# Altium project 2011_CurrentIntegrator.PrjPcb
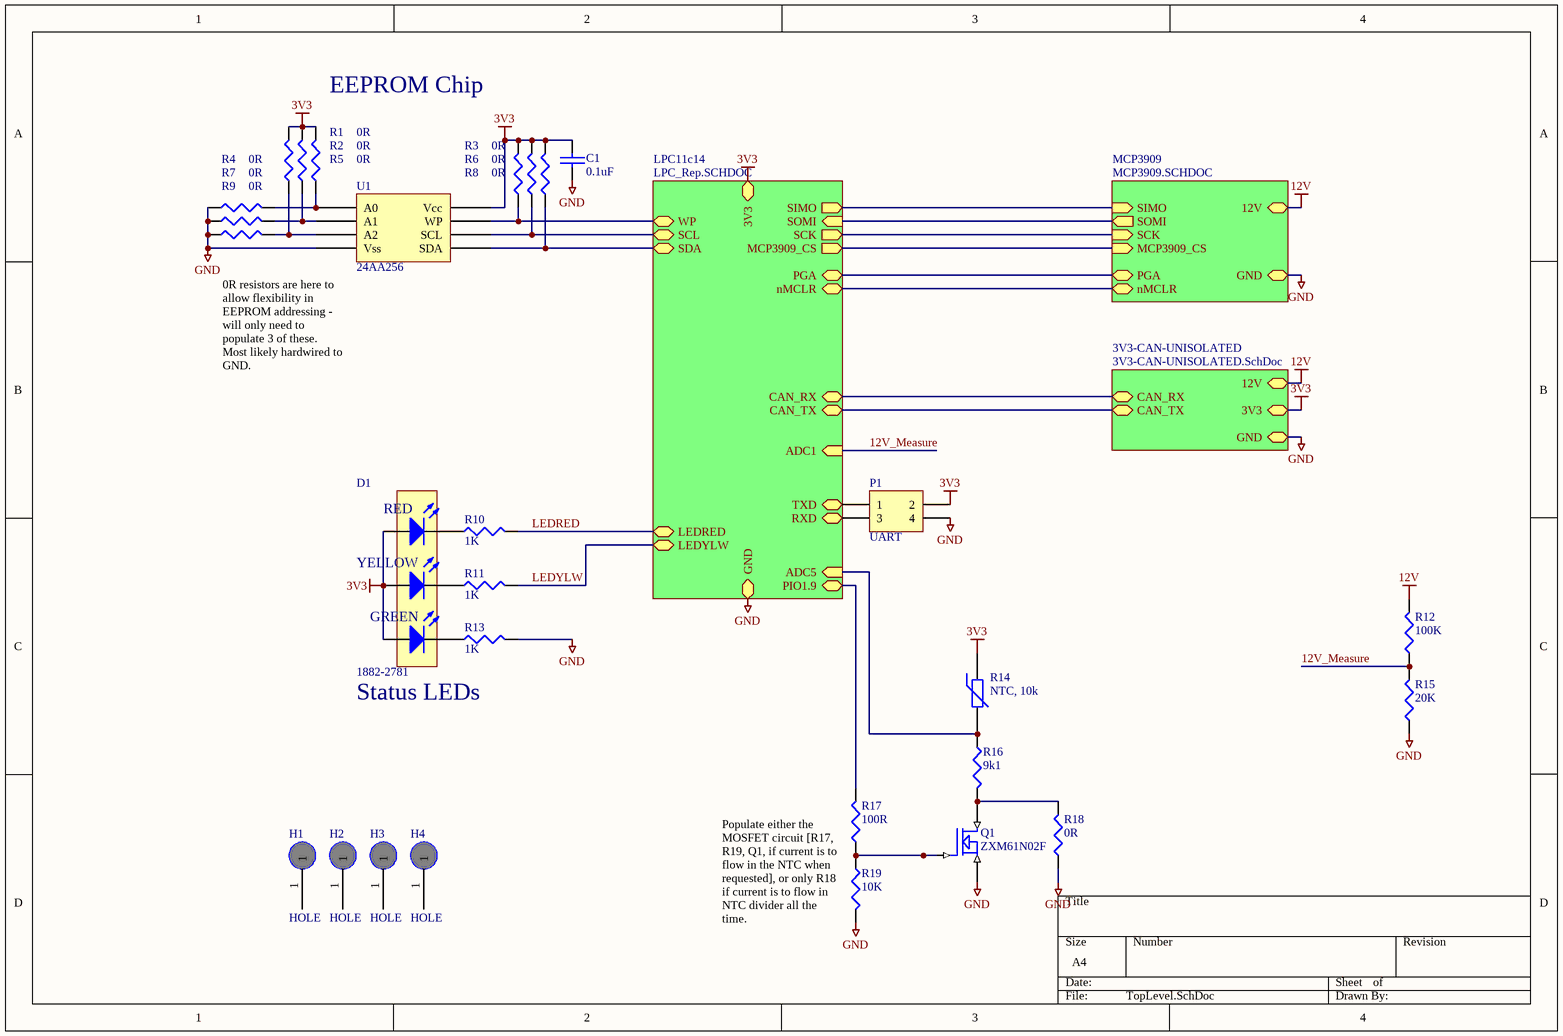
[diagram p0: TopLevel.SchDoc]
5 sheets, 113 parts. Net scope: hierarchical (ports join the sheet entries above them; power ports are global).
Board file: 2011_CurrentIntegrator2.PcbDoc
Sheets:
  TopLevel.SchDoc
    LPC11c14 = LPC_Rep.SchDoc
    MCP3909 = MCP3909.SchDoc
    3V3-CAN-UNISOLATED = 3V3-CAN-UNISOLATED.SchDoc
      U_3V-Switcher-50mA = 3V-Switcher-50mA.SCHDOC

## Sheet TopLevel.SchDoc
size A4

### Parts
C1  0.1uF  [0805]
D1  1882-2781  [LED_TRILEVEL]
H1  HOLE  [M2.5]
H2  HOLE  [M2.5]
H3  HOLE  [M2.5]
H4  HOLE  [M2.5]
P1  UART  [HDR2X2]
Q1  ZXM61N02F  [SOT23-3]
R1  0R  [0603]
R2  0R  [0603]
R3  0R  [0603]
R4  0R  [0603]
R5  0R  [0603]
R6  0R  [0603]
R7  0R  [0603]
R8  0R  [0603]
R9  0R  [0603]
R10  1K  [0603]
R11  1K  [0603]
R12  100K  [1206]
R13  1K  [0603]
R14  NTC, 10k  [NTC_EPCOS]
R15  20K  [1206]
R16  9k1  [0603]
R17  100R  [0603]
R18  0R  [0603]
R19  10K  [0603]
U1  24AA256  [DIP8]

### Sub-sheets
3V3-CAN-UNISOLATED = 3V3-CAN-UNISOLATED.SchDoc: CAN_RX, CAN_TX, GND, 12V, 3V3
LPC11c14 = LPC_Rep.SCHDOC: SIMO (out), SOMI (in), SCK (out), MCP3909_CS (out), PGA, nMCLR, CAN_RX, CAN_TX, 3V3, GND, SCL, SDA, WP, LEDRED, LEDYLW, ADC5 (in), PIO1.9, ADC1 (in), TXD, RXD
MCP3909 = MCP3909.SCHDOC: SIMO (in), SOMI (out), SCK (in), MCP3909_CS (in), PGA, nMCLR, 12V, GND

### Nets
3V3: C1.1 D1.4(A) D1.5(A) D1.6(A) P1.2 R1.2 R2.2 R3.2 R5.2 R6.2 R8.2 R14.1 U1.8(Vcc) ; sheet LPC11c14/3V3, sheet 3V3-CAN-UNISOLATED/3V3
12V: R12.2 ; sheet MCP3909/12V, sheet 3V3-CAN-UNISOLATED/12V
GND: C1.2 P1.4 Q1.2(S) R4.1 R7.1 R9.1 R13.2 R15.1 R18.1 R19.2 U1.4(Vss) ; sheet LPC11c14/GND, sheet MCP3909/GND, sheet 3V3-CAN-UNISOLATED/GND
12V_Measure: R12.1 R15.2 ; sheet LPC11c14/ADC1
LEDRED: R10.2 ; sheet LPC11c14/LEDRED
LEDYLW: R11.2 ; sheet LPC11c14/LEDYLW
NetD1_1: D1.1(K) R13.1
NetD1_2: D1.2(K) R11.1
NetD1_3: D1.3(K) R10.1
NetP1_1: P1.1 ; sheet LPC11c14/TXD
NetP1_3: P1.3 ; sheet LPC11c14/RXD
NetQ1_1: Q1.1(G) R17.1 R19.1
NetQ1_3: Q1.3(D) R16.2 R18.2
NetR1_1: R1.1 R4.2 U1.1(A0)
NetR2_1: R2.1 R7.2 U1.2(A1)
NetR3_1: R3.1 U1.5(SDA) ; sheet LPC11c14/SDA
NetR5_1: R5.1 R9.2 U1.3(A2)
NetR6_1: R6.1 U1.6(SCL) ; sheet LPC11c14/SCL
NetR8_1: R8.1 U1.7(WP) ; sheet LPC11c14/WP
NetR14_2: R14.2 R16.1 ; sheet LPC11c14/ADC5
NetR17_2: R17.2 ; sheet LPC11c14/PIO1.9
NetU2_1: sheet LPC11c14/CAN_TX, sheet 3V3-CAN-UNISOLATED/CAN_TX
NetU2_4: sheet LPC11c14/CAN_RX, sheet 3V3-CAN-UNISOLATED/CAN_RX
NetU3_11: sheet LPC11c14/PGA, sheet MCP3909/PGA
NetU3_12: sheet LPC11c14/nMCLR, sheet MCP3909/nMCLR
NetU3_13: sheet LPC11c14/SCK, sheet MCP3909/SCK
NetU3_26: sheet LPC11c14/SOMI, sheet MCP3909/SOMI
NetU3_27: sheet LPC11c14/MCP3909_CS, sheet MCP3909/MCP3909_CS
NetU3_38: sheet LPC11c14/SIMO, sheet MCP3909/SIMO

Not connected (* = marked no-connect by the designer): H1 1; H2 1; H3 1; H4 1

### Notes on the sheet
- EEPROM Chip
- 0R resistors are here to allow flexibility in EEPROM addressing - will only need to populate 3 of these. Most likely hardwired to GND.
- Status LEDs
- Populate either the MOSFET circuit [R17, R19, Q1, if current is to flow in the NTC when requested], or only R18 if current is to flow in NTC divider all the time.
- (in symbol LED-TRILEVEL) RED; YELLOW; GREEN

### Library data of the parts
C1 = CAP: Capacitor; Order#: ??; Price: ??; Supplier: ??
D1 = LED-TRILEVEL: Three level LED; Farnell: 1461596
P1 = Header 2X2: Header, 2-Pin, Dual row; LatestRevisionDate: 17-Jul-2002; LatestRevisionNote: Re-released for DXP Platform.; Publisher: Altium Limited
Q1 = ZXM61N02F: 1.7A, 20V N-Channel Enhancement mode FET; Order#: 9525270; Price: 0.803; Supplier: Farnell
R1-R9 = RES1: Resistor; Order#: 933-1697; Price: 0.11; Supplier: Farnell
R10 R11 R13 = RES1: Resistor; Order#: 9331697; Supplier: Farnell; Price: 0.05
R12 R15 = RES1: Resistor; Farnell: *
R14 = Res Varistor: Varistor (Voltage-Sensitive Resistor); EPCOS: B57540G0103F00; Farnell: 1712520
R16 = RES1: Resistor; Order#: 9330380; Supplier: Farnell; Price: 0.066
R17-R19 = RES1: Resistor; Order#: 9233253; Supplier: Farnell; Price: 0.088

## Sheet LPC_Rep.SchDoc
size A4; Organization: UNSW Solar Racing Team; Address3: UNSW; Address4: Sydney NSW 2052; Address2: Electrical Engineering; Address1: Rm 109
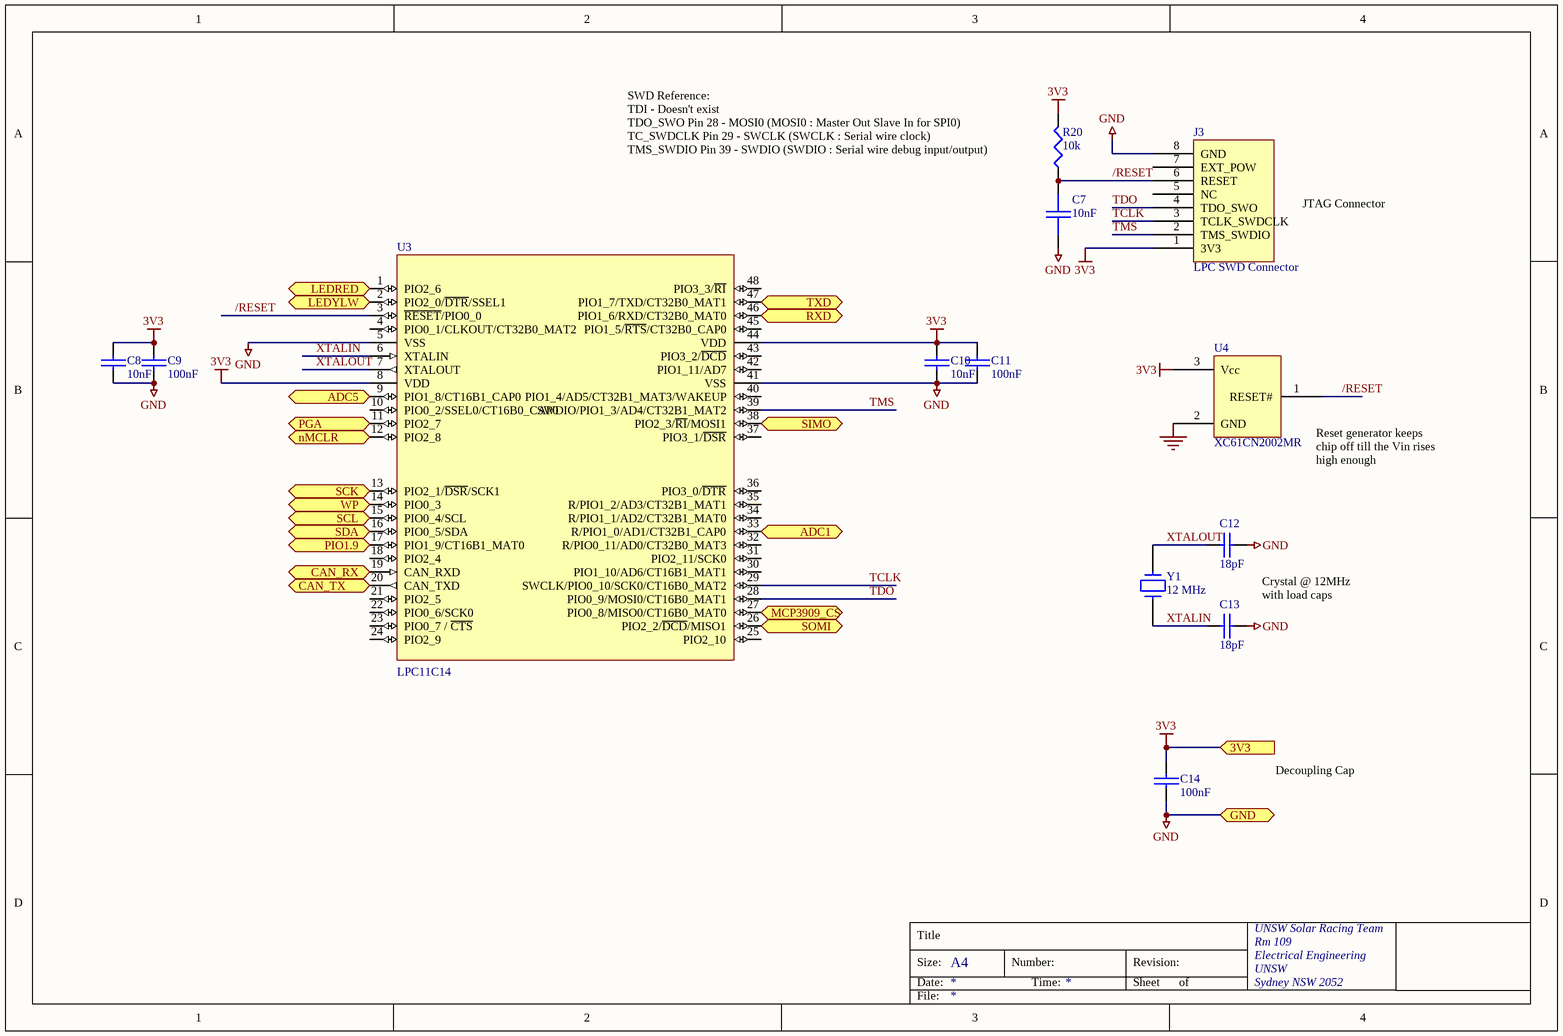
[diagram p1: LPC_Rep.SchDoc]

### Parts
C7  10nF  [0603]
C8  10nF  [0603]
C9  100nF  [0603]
C10  10nF  [0603]
C11  100nF  [0603]
C12  18pF  [0603]
C13  18pF  [0603]
C14  100nF  [0603]
J3  LPC SWD Connector  [IDC8]
R20  10k  [0603]
U3  LPC11C14  [Quad48-LPC11c14]
U4  XC61CN2002MR  [SOT23-3]
Y1  12 MHz  [HC49/4H]

### Ports
3V3, ADC1 (in), ADC5 (in), CAN_RX (in), CAN_TX (out), GND, LEDRED (bidir), LEDYLW (bidir), MCP3909_CS, nMCLR, PGA, PIO1.9 (bidir), RXD (bidir), SCK (bidir), SCL (bidir), SDA (bidir), SIMO (bidir), SOMI (bidir), TXD (bidir), WP (bidir)

### Nets
3V3: C8.2 C9.2 C10.2 C11.2 C14.1 J3.1(3V3) R20.2 U3.8(VDD) U3.44(VDD) U4.3(Vcc) ; port 3V3
GND: C7.2 C8.1 C9.1 C10.1 C11.1 C12.2 C13.2 C14.2 J3.8(GND) U3.5(VSS) U3.41(VSS) U4.2(GND) ; port GND
12V_Measure: U3.33(R/PIO1_0/AD1/CT32B1_CAP0) ; port ADC1
/RESET: C7.1 J3.6(RESET) R20.1 U3.3(~{RESET}/PIO0_0) U4.1(RESET#)
LEDRED: U3.1(PIO2_6) ; port LEDRED
LEDYLW: U3.2(PIO2_0/~{DTR}/SSEL1) ; port LEDYLW
TCLK: J3.3(TCLK_SWDCLK) U3.29(SWCLK/PIO0_10/SCK0/CT16B0_MAT2)
TDO: J3.4(TDO_SWO) U3.28(PIO0_9/MOSI0/CT16B0_MAT1)
TMS: J3.2(TMS_SWDIO) U3.39(SWDIO/PIO1_3/AD4/CT32B1_MAT2)
XTALIN: C13.1 U3.6(XTALIN) Y1.1
XTALOUT: C12.1 U3.7(XTALOUT) Y1.2
NetP1_1: U3.47(PIO1_7/TXD/CT32B0_MAT1) ; port TXD
NetP1_3: U3.46(PIO1_6/RXD/CT32B0_MAT0) ; port RXD
NetR3_1: U3.16(PIO0_5/SDA) ; port SDA
NetR6_1: U3.15(PIO0_4/SCL) ; port SCL
NetR8_1: U3.14(PIO0_3) ; port WP
NetR14_2: U3.9(PIO1_8/CT16B1_CAP0) ; port ADC5
NetR17_2: U3.17(PIO1_9/CT16B1_MAT0) ; port PIO1.9
NetU2_1: U3.20(CAN_TXD) ; port CAN_TX
NetU2_4: U3.19(CAN_RXD) ; port CAN_RX
NetU3_11: U3.11(PIO2_7) ; port PGA
NetU3_12: U3.12(PIO2_8) ; port nMCLR
NetU3_13: U3.13(PIO2_1/~{DSR}/SCK1) ; port SCK
NetU3_26: U3.26(PIO2_2/~{DCD}/MISO1) ; port SOMI
NetU3_27: U3.27(PIO0_8/MISO0/CT16B0_MAT0) ; port MCP3909_CS
NetU3_38: U3.38(PIO2_3/~{RI}/MOSI1) ; port SIMO

Not connected (* = marked no-connect by the designer): J3 5(NC) 7(EXT_POW); U3 4(PIO0_1/CLKOUT/CT32B0_MAT2) 10(PIO0_2/SSEL0/CT16B0_CAP0) 18(PIO2_4) 21(PIO2_5) 22(PIO0_6/SCK0) 23(PIO0_7_/_~{CTS}) 24(PIO2_9) 25(PIO2_10) 30(PIO1_10/AD6/CT16B1_MAT1) 31(PIO2_11/SCK0) 32(R/PIO0_11/AD0/CT32B0_MAT3) 34(R/PIO1_1/AD2/CT32B1_MAT0) 35(R/PIO1_2/AD3/CT32B1_MAT1) 36(PIO3_0/~{DTR}) 37(PIO3_1/~{DSR}) 40(PIO1_4/AD5/CT32B1_MAT3/WAKEUP) 42(PIO1_11/AD7) 43(PIO3_2/~{DCD}) 45(PIO1_5/~{RTS}/CT32B0_CAP0) 48(PIO3_3/~{RI})

### Notes on the sheet
- SWD Reference:
  TDI - Doesn't exist
  TDO_SWO Pin 28 - MOSI0 (MOSI0 : Master Out Slave In for SPI0)
  TC_SWDCLK Pin 29 - SWCLK (SWCLK : Serial wire clock)
  TMS_SWDIO Pin 39 - SWDIO (SWDIO : Serial wire debug input/output)
- JTAG Connector
- (near U4) Reset generator keeps chip off till the Vin rises high enough
- Crystal @ 12MHz with load caps
- Decoupling Cap
- Title
- Size:
- Date:
- A4
- Number:
- Time:
- Revision:
- Sheet
- of
- File:

### Library data of the parts
C7-C14 = CAP: Capacitor
  C7: Farnell: 722-236; Price: 0.15
  C8-C11 C14: Farnell: 753-567; Price: 0.31
  C12 C13: Farnell: 721-992; Price: 0.11
J3 = LPCLink_Connector: Farnell: 511-808; Price: 1.32
R20 = RES1: Resistor; Farnell: 612-601; Price: 0.11
U3 = LPC11C14_Full: Farnell: NA
U4 = XC61F: SOT23 reset generator; Farnell: NA
Y1 = CRYSTAL: Farnell: 485-111; Price: 3.38

## Sheet MCP3909.SchDoc
size A4
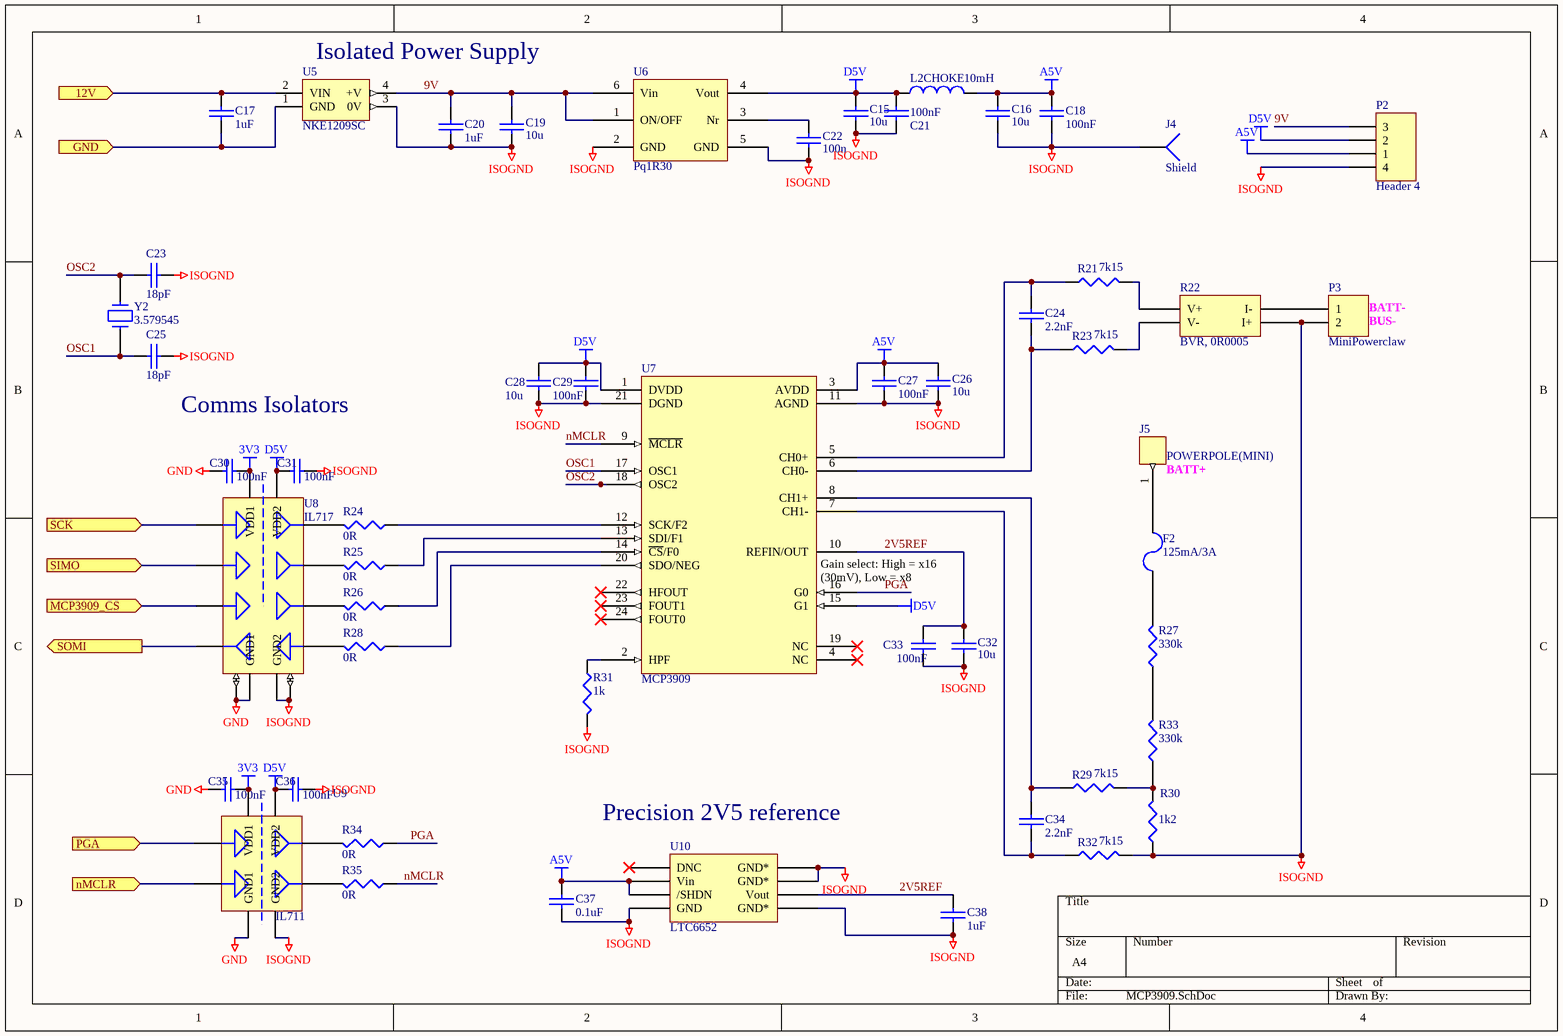
[diagram p2: MCP3909.SchDoc]

### Parts
C15  10u  [0805]
C16  10u  [0805]
C17  1uF  [0805]
C18  100nF  [0603]
C19  10u  [0805]
C20  1uF  [0805]
C21  100nF  [0603]
C22  100n  [0603]
C23  18pF  [0603]
C24  2.2nF  [0603]
C25  18pF  [0603]
C26  10u  [0805]
C27  100nF  [0603]
C28  10u  [0805]
C29  100nF  [0603]
C30  100nF  [0603]
C31  100nF  [0603]
C32  10u  [0805]
C33  100nF  [0603]
C34  2.2nF  [0603]
C35  100nF  [0603]
C36  100nF  [0603]
C37  0.1uF  [0805]
C38  1uF  [0805]
F2  125mA/3A  [LITTELFUSE-154-250V]
J4  Shield  [BMIS-203-SHIELD]
J5  POWERPOLE(MINI)  [POWERPOLE25A]
L2  CHOKE  value 10mH  [1812]
P2  Header 4  [HDR1X4]
P3  MiniPowerclaw  [MiniPowerpole-Hrz]
R21  7k15  [0603]
R22  BVR, 0R0005  [BVR]
R23  7k15  [0603]
R24  0R  [0603]
R25  0R  [0603]
R26  0R  [0603]
R27  330k  [1206]
R28  0R  [0603]
R29  7k15  [0603]
R30  1k2  [1206]
R31  1k  [0603]
R32  7k15  [0603]
R33  330k  [1206]
R34  0R  [0603]
R35  0R  [0603]
U5  NKE1209SC  [NPSIP4]
U6  Pq1R30  [SOT23-6]
U7  MCP3909  [SOP24-wide]
U8  IL717  [SO16]
U9  IL711  [SO8]
U10  LTC6652  [SOP8 - duplicate]
Y2  3.579545  [HC49/4H]

### Ports
12V (in), GND, MCP3909_CS (in), nMCLR (in), PGA (in), SCK (in), SIMO (in), SOMI (out)

### Nets
3V3: C30.2 C35.2 U8.1(VDD1) U9.1(VDD1)
12V: C17.1 U5.2(VIN) ; port 12V
A5V: C16.2 C18.1 C26.2 C27.1 C37.1 L2.2 P2.1 U7.3(AVDD) U10.2(Vin) U10.3(/SHDN)
D5V: C15.2 C21.1 C28.2 C29.2 C31.2 C36.2 L2.1 P2.2 U6.4(Vout) U7.1(DVDD) U7.15(G1) U8.16(VDD2) U9.8(VDD2)
GND: C17.2 C30.1 C35.1 U5.1(GND) U8.2(GND1) U8.8(GND1) U9.4(GND1) ; port GND
ISOGND: C15.1 C16.1 C18.2 C19.1 C20.2 C21.2 C22.1 C23.2 C25.2 C26.1 C27.2 C28.1 C29.1 C31.1 C32.1 C33.2 C36.1 C37.2 C38.1 J4.1 P2.4 P3.2 R22.4(I+) R30.1 R31.2 R32.2 U5.3(0V) U6.2(GND) U6.5(GND) U7.11(AGND) U7.21(DGND) U8.9(GND2) U8.15(GND2) U9.5(GND2) U10.4(GND) U10.5(GND*) U10.7(GND*) U10.8(GND*)
2V5REF: C32.2 C33.1 C38.2 U7.10(REFIN/OUT) U10.6(Vout)
9V: C19.2 C20.1 P2.3 U5.4(+V) U6.1(ON/OFF) U6.6(Vin)
nMCLR: R35.1 U7.9(~{MCLR})
OSC1: C25.1 U7.17(OSC1) Y2.1
OSC2: C23.1 U7.18(OSC2) Y2.2
PGA: R34.1 U7.16(G0)
NetC22_2: C22.2 U6.3(Nr)
NetC24_1: C24.1 R23.1 U7.6(CH0-)
NetC24_2: C24.2 R21.1 U7.5(CH0+)
NetC34_1: C34.1 R29.1 U7.8(CH1+)
NetC34_2: C34.2 R32.1 U7.7(CH1-)
NetF2_1: F2.1 R27.2
NetF2_2: F2.2 J5.1
NetP3_1: P3.1 R22.3(I-)
NetR21_2: R21.2 R22.1(V+)
NetR22_2: R22.2(V-) R23.2
NetR24_1: R24.1 U7.12(SCK/F2)
NetR24_2: R24.2 U8.14(OUT1)
NetR25_1: R25.1 U7.13(SDI/F1)
NetR25_2: R25.2 U8.13(OUT2)
NetR26_1: R26.1 U7.14(~{CS}/F0)
NetR26_2: R26.2 U8.12(OUT3)
NetR27_1: R27.1 R33.2
NetR28_1: R28.1 U7.20(SDO/NEG)
NetR28_2: R28.2 U8.11(IN4)
NetR29_2: R29.2 R30.2 R33.1
NetR31_1: R31.1 U7.2(HPF)
NetR34_2: R34.2 U9.7(OUT1)
NetR35_2: R35.2 U9.6(OUT2)
NetU3_11: U9.2(IN1) ; port PGA
NetU3_12: U9.3(IN2) ; port nMCLR
NetU3_13: U8.3(IN1) ; port SCK
NetU3_26: U8.6(OUT4) ; port SOMI
NetU3_27: U8.5(IN3) ; port MCP3909_CS
NetU3_38: U8.4(IN2) ; port SIMO

Not connected (* = marked no-connect by the designer): U7 4(NC)* 19(NC)* 22(HFOUT)* 23(FOUT1)* 24(FOUT0)*; U10 1(DNC)*

### Notes on the sheet
- (near U5) Isolated Power Supply
- (near P3) BATT-
- (near P3) BUS-
- Comms Isolators
- (near J5) BATT+
- (near U7) Gain select: High = x16 (30mV), Low = x8 (60mV)
- (near U10) Precision 2V5 reference

### Library data of the parts
C15 C16 C19 C22 C26 C28 C32 = CAP: Capacitor; Order#: 521-2820; Price: 0.489; Supplier: Farnell
C17 C20 C37 C38 = CAP: Capacitor; Order#: ??; Price: ??; Supplier: ??
C18 C21 C27 C29-C31 C33 C35 C36 = CAP: Capacitor; Order#: 753-567; Price: 0.31; Supplier: Farnell
C23 C25 = CAP: Capacitor; Order#: 721-992; Price: 0.11; Supplier: Farnell
C24 C34 = CAP: Capacitor; Order#: 498-592; Price: 0.128; Supplier: Farnell
F2 = FUSE2: Fuse; Order#: 994-3609; Other Info: www.littelfuse.com; Price: 7.78; Supplier: Farnell
J4 = Socket: LatestRevisionDate: 17-Jul-2002; LatestRevisionNote: Re-released for DXP Platform.; Publisher: Altium Limited
J5 = CON1: RS: 534-979 + 534-963; Farnell: -; Digikey: -
L2 = INDUCTOR: Manufacturer: Generic Components; Class I: Passive; Published: 8-Jun-2000; Revision: July-2002: Re-released for DXP Platform.; Publisher: Altium Limited; Class II: Inductor
P2 = Header 4: Header, 4-Pin; LatestRevisionDate: 17-Jul-2002; LatestRevisionNote: Re-released for DXP Platform.; Publisher: Altium Limited
P3 = Header 2: Header, 2-Pin; pin to pad: 1>2 2>1; LatestRevisionDate: 17-Jul-2002; LatestRevisionNote: Re-released for DXP Platform.; Publisher: Altium Limited
R21 R23 R29 R31 R32 = RES1: Resistor; Order#: 933-1697; Price: 0.11; Supplier: Farnell
R22 = BVR
R24-R26 R28 R34 R35 = RES1: Resistor; Order#: 9233253; Supplier: Farnell; Price: 0.088
R27 R33 = RES1: Order#: 308-9587; Price: 1.160; Supplier: Farnell
R30 = RES1: Resistor; Value: 0.002; Order#: BVS-A-R002; Supplier: Isotek (http://www.isotekcorp.com); Price: 1.12USD
U5 = LME1209S: Isolated 250mW Single Output; RS: 689-5034
U7 = MCP3909: Energy Measurement IC; Order#: MCP3909-I/SS-ND; Price: 2.8800; Supplier: Digikey
U8 = IL717: Isoloop IL717 - www.nve.com; Order#: 957-0659; Price: 19.20; Supplier: Farnell
U9 = IL711: IL711 Optical Isolator; Order#: 1314985; Price: 9.97; Supplier: Farnell
Y2 = CRYSTAL: Order#: 971-2895; Price: 3.98; Supplier: Farnell
U10 = LTC6652: Farnell: 1556273

## Sheet 3V3-CAN-UNISOLATED.SchDoc
size A4; Organization: UNSW Solar Racing Team; Address3: UNSW; Address4: Sydney NSW 2052; Address2: Electrical Engineering; Address1: Rm 109
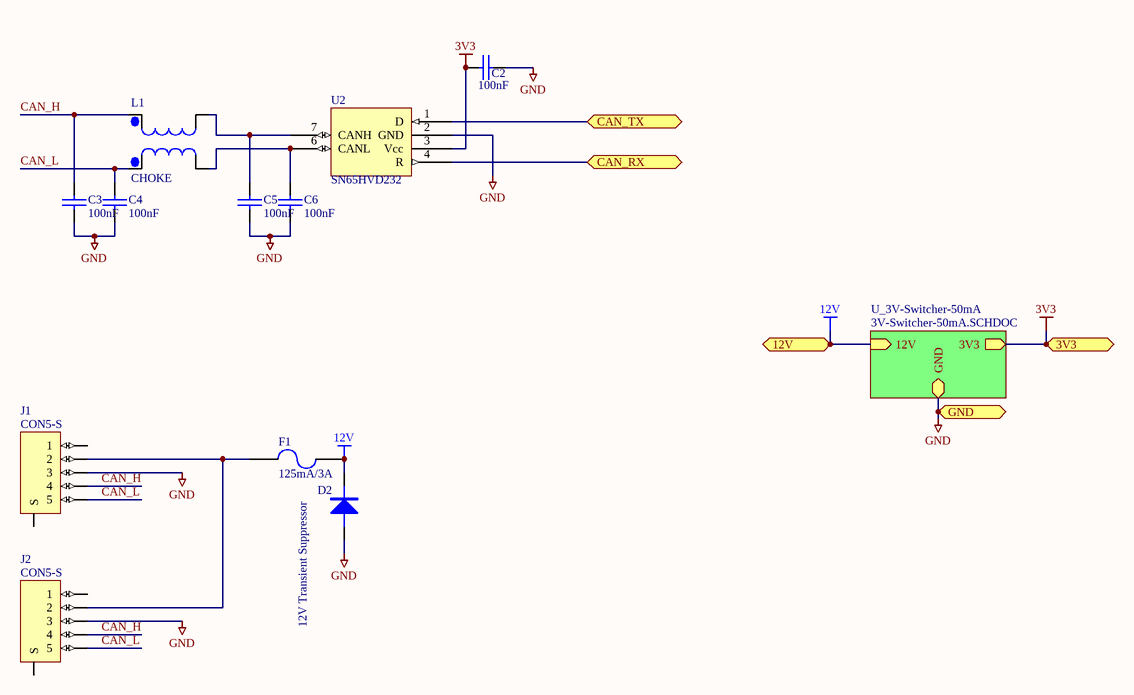
[diagram p3: 3V3-CAN-UNISOLATED.SchDoc]

### Parts
C2  100nF  [0603]
C3  100nF  [0603]
C4  100nF  [0603]
C5  100nF  [0603]
C6  100nF  [0603]
D2  12V Transient Suppressor  [SMA]
F1  125mA/3A  [LITTELFUSE-154]
J1  CON5-S  [TRIAD5F]
J2  CON5-S  [TRIAD5F]
L1  CHOKE  [Epcos-Choke]
U2  SN65HVD232  [SO8]

### Sub-sheets
U_3V-Switcher-50mA = 3V-Switcher-50mA.SCHDOC: GND, 3V3, 12V

### Ports
3V3, 12V, CAN_RX, CAN_TX, GND

### Nets
3V3: C2.2 U2.3(Vcc) ; port 3V3, sheet U_3V-Switcher-50mA/3V3
12V: D2.K F1.2 ; port 12V, sheet U_3V-Switcher-50mA/12V
GND: C2.1 C3.1 C4.2 C5.2 C6.2 D2.A J1.3 J2.3 U2.2(GND) ; port GND, sheet U_3V-Switcher-50mA/GND
CAN_H: C3.2 J1.4 J2.4 L1.1
CAN_L: C4.1 J1.5 J2.5 L1.2
NetC5_1: C5.1 L1.4 U2.7(CANH)
NetC6_1: C6.1 L1.3 U2.6(CANL)
NetF1_1: F1.1 J1.2 J2.2
NetU2_1: U2.1(D) ; port CAN_TX
NetU2_4: U2.4(R) ; port CAN_RX

Not connected (* = marked no-connect by the designer): J1 0(S) 1; J2 0(S) 1

### Notes on the sheet
- Title
- Size:
- Date:
- A4
- Number:
- Time:
- Revision:
- Sheet
- of
- File:

### Library data of the parts
C2-C6 = CAP: Capacitor; Order#: 753-567; Price: 0.31; Supplier: Farnell
D2 = DIODE: Order#: 980-2754; Price: 1.25; Supplier: Farnell
F1 = FUSE2: Fuse; Order#: 994-3609; Other Info: www.littelfuse.com; Price: 7.78; Supplier: Farnell
J1 J2 = CON5-S: Connector, 2 pin, with shield @ S; Order#: 131-040; Price: 23.50; Supplier: Farnell
U2 = SN65HVD232: 3.3V CAN Transciever; Order#: 296-12282-5-ND; Supplier: Digikey; Price: 2.93

## Sheet 3V-Switcher-50mA.SCHDOC
size A4; Organization: UNSW Solar Racing Team; Address3: UNSW; Address4: Sydney NSW 2052; Address2: Electrical Engineering; Address1: Rm 109
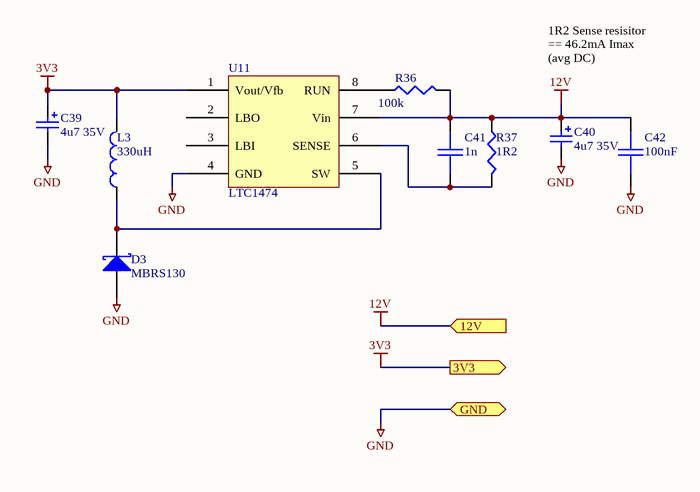
[diagram p4: 3V-Switcher-50mA.SCHDOC]

### Parts
C39  4u7 35V  [MCCT-CASEC]
C40  4u7 35V  [MCCT-CASEC]
C41  1n  [0603]
C42  100nF  [0603]
D3  MBRS130  [SMB]
L3  330uH  [1812]
R36  100k  [0603]
R37  1R2  [0603]
U11  LTC1474  [TSOP8]

### Ports
3V3 (out), 12V (in), GND (bidir)

### Nets
3V3: C39.1 L3.2 U11.1(Vout/Vfb) ; port 3V3
12V: C40.1 C41.1 C42.1 R36.2 R37.1 U11.7(Vin) ; port 12V
GND: C39.2 C40.2 C42.2 D3.A U11.4(GND) ; port GND
NetC41_2: C41.2 R37.2 U11.6(SENSE)
NetD3_K: D3.K L3.1 U11.5(SW)
NetR36_1: R36.1 U11.8(RUN)

Not connected (* = marked no-connect by the designer): U11 2(LBO) 3(LBI)

### Notes on the sheet
- 1R2 Sense resisitor == 46.2mA Imax (avg DC)
- Title
- Size:
- Date:
- A4
- Number:
- Time:
- Revision:
- Sheet
- of
- File:

### Library data of the parts
C39 C40 = Cap Pol3: Polarized Capacitor (Surface Mount); Value: 4.7uF; Order#: 197-609; Revision: July-2002: Re-released for DXP Platform.; Price: 1.41; Supplier: Farnell
C41 = CAP: Capacitor; Value: 1nF; Order#: 317-202; Revision: July-2002: Re-released for DXP Platform.; Price: 0.15; Supplier: Farnell
C42 = CAP: Capacitor; Value: 0.1uF; Order#: 753-567; Revision: July-2002: Re-released for DXP Platform.; Price: 0.31; Supplier: Farnell
D3 = D SCHOTTKY: Schottky Diode; Order#: 9556931; Revision: July-2002: Re-released for DXP Platform.; Price: 1.49; Supplier: Farnell
L3 = Inductor: Order#: 8808538; Revision: July-2002: Re-released for DXP Platform.; Value: 330uH; Price: 1.96; Supplier: Farnell
R36 = RES1: Resistor; Order#: 933-3738; Value: 100k; Price: 0.13; Supplier: Farnell
R37 = RES1: Resistor; Value: 1.2R; Order#: 139-9658; Revision: July-2002: Re-released for DXP Platform.; Price: 0.63; Supplier: Farnell
U11 = LTC1474: Step-down converter; Order#: LTC1474CMS8-3.3-ND; Price: 7.50USD; Supplier: Digikey

## Nets that join several sheets
3V3: TopLevel (13 pins), LPC_Rep (10 pins), MCP3909 (C30.2 C35.2 U8.1 U9.1), 3V3-CAN-UNISOLATED (C2.2 U2.3), 3V-Switcher-50mA (C39.1 L3.2 U11.1)
12V: TopLevel (R12.2), MCP3909 (C17.1 U5.2), 3V3-CAN-UNISOLATED (D2.K F1.2), 3V-Switcher-50mA (6 pins)
GND: TopLevel (11 pins), LPC_Rep (12 pins), MCP3909 (7 pins), 3V3-CAN-UNISOLATED (9 pins), 3V-Switcher-50mA (5 pins)
12V_Measure: TopLevel (R12.1 R15.2), LPC_Rep (U3.33)
LEDRED: TopLevel (R10.2), LPC_Rep (U3.1)
LEDYLW: TopLevel (R11.2), LPC_Rep (U3.2)
NetP1_1: TopLevel (P1.1), LPC_Rep (U3.47)
NetP1_3: TopLevel (P1.3), LPC_Rep (U3.46)
NetR3_1: TopLevel (R3.1 U1.5), LPC_Rep (U3.16)
NetR6_1: TopLevel (R6.1 U1.6), LPC_Rep (U3.15)
NetR8_1: TopLevel (R8.1 U1.7), LPC_Rep (U3.14)
NetR14_2: TopLevel (R14.2 R16.1), LPC_Rep (U3.9)
NetR17_2: TopLevel (R17.2), LPC_Rep (U3.17)
NetU2_1: LPC_Rep (U3.20), 3V3-CAN-UNISOLATED (U2.1)
NetU2_4: LPC_Rep (U3.19), 3V3-CAN-UNISOLATED (U2.4)
NetU3_11: LPC_Rep (U3.11), MCP3909 (U9.2)
NetU3_12: LPC_Rep (U3.12), MCP3909 (U9.3)
NetU3_13: LPC_Rep (U3.13), MCP3909 (U8.3)
NetU3_26: LPC_Rep (U3.26), MCP3909 (U8.6)
NetU3_27: LPC_Rep (U3.27), MCP3909 (U8.5)
NetU3_38: LPC_Rep (U3.38), MCP3909 (U8.4)